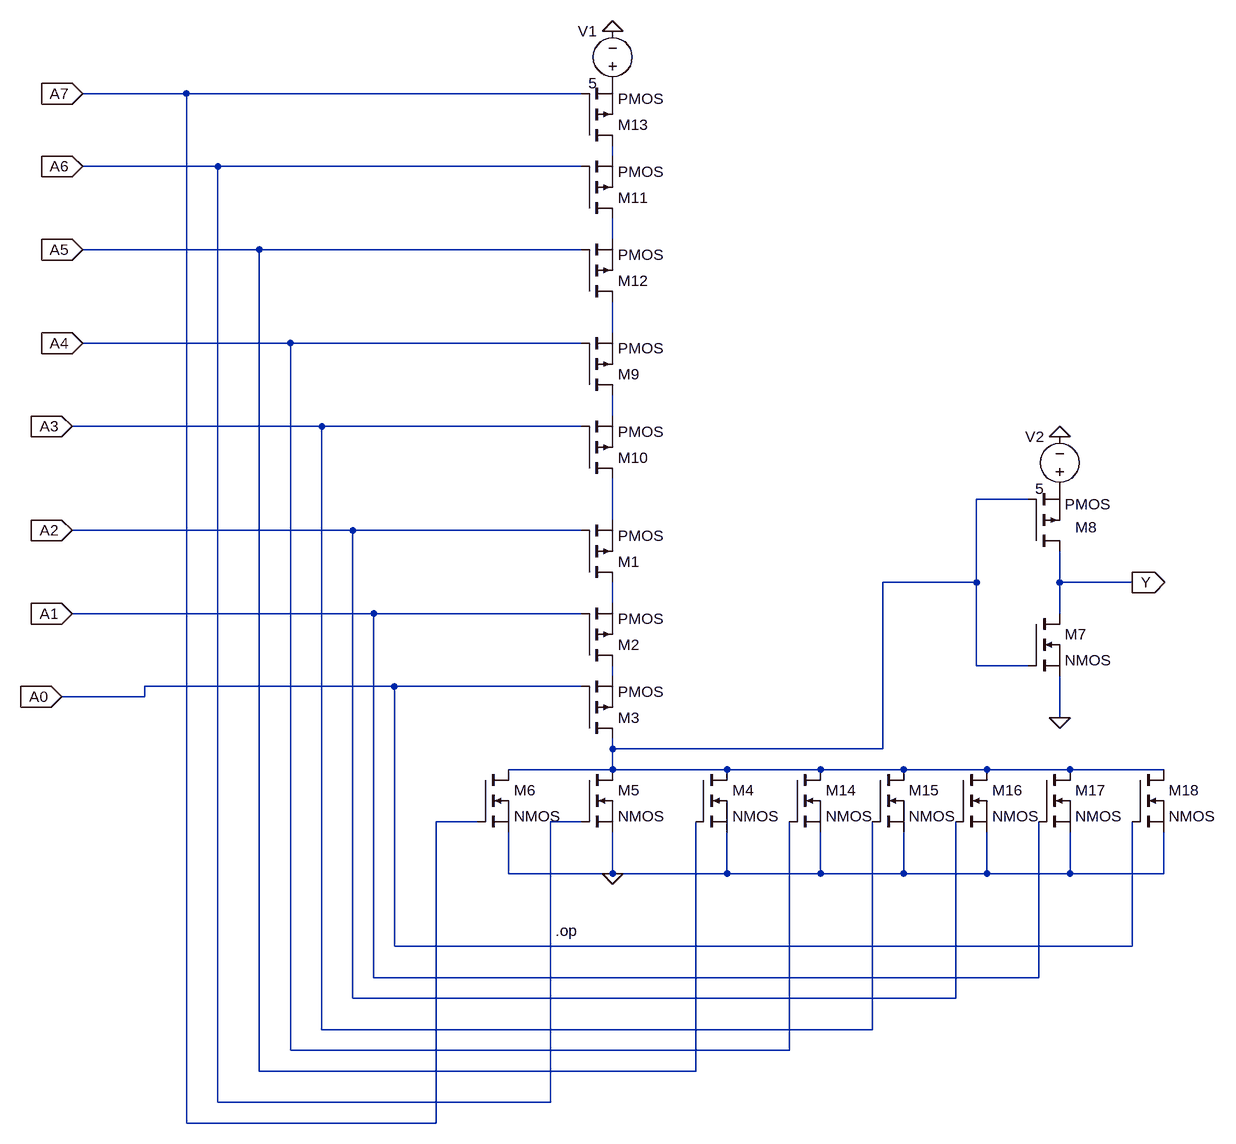
[diagram p0: schematic OR.asc]
OR.asc, the LTspice schematic file:
Version 4
SHEET 1 1532 680
WIRE -480 -1184 -640 -1184
WIRE 128 -1184 -480 -1184
WIRE 176 -1088 176 -1104
WIRE -432 -1072 -640 -1072
WIRE 128 -1072 -432 -1072
WIRE 176 -960 176 -992
WIRE -368 -944 -640 -944
WIRE 128 -944 -368 -944
WIRE 176 -816 176 -864
WIRE -320 -800 -640 -800
WIRE 128 -800 -320 -800
WIRE 176 -688 176 -720
WIRE -272 -672 -656 -672
WIRE 128 -672 -272 -672
WIRE 816 -560 736 -560
WIRE 176 -528 176 -592
WIRE -224 -512 -656 -512
WIRE 128 -512 -224 -512
WIRE 736 -432 736 -560
WIRE 736 -432 592 -432
WIRE 864 -432 864 -480
WIRE 976 -432 864 -432
WIRE 176 -400 176 -432
WIRE -192 -384 -656 -384
WIRE 128 -384 -192 -384
WIRE 864 -384 864 -432
WIRE 736 -304 736 -432
WIRE 816 -304 736 -304
WIRE 176 -288 176 -304
WIRE -160 -272 -544 -272
WIRE 128 -272 -160 -272
WIRE -544 -256 -544 -272
WIRE -544 -256 -672 -256
WIRE 864 -224 864 -288
WIRE 176 -176 176 -192
WIRE 592 -176 592 -432
WIRE 592 -176 176 -176
WIRE 176 -144 176 -176
WIRE 176 -144 16 -144
WIRE 352 -144 176 -144
WIRE 496 -144 352 -144
WIRE 624 -144 496 -144
WIRE 752 -144 624 -144
WIRE 880 -144 752 -144
WIRE 1024 -144 880 -144
WIRE 176 -128 176 -144
WIRE -32 -64 -96 -64
WIRE 128 -64 80 -64
WIRE 16 16 16 -48
WIRE 176 16 176 -48
WIRE 176 16 16 16
WIRE 352 16 352 -48
WIRE 352 16 176 16
WIRE 496 16 496 -48
WIRE 496 16 352 16
WIRE 624 16 624 -48
WIRE 624 16 496 16
WIRE 752 16 752 -48
WIRE 752 16 624 16
WIRE 880 16 880 -48
WIRE 880 16 752 16
WIRE 1024 16 1024 -48
WIRE 1024 16 880 16
WIRE -160 128 -160 -272
WIRE 976 128 976 -64
WIRE 976 128 -160 128
WIRE -192 176 -192 -384
WIRE 832 176 832 -64
WIRE 832 176 -192 176
WIRE -224 208 -224 -512
WIRE 704 208 704 -64
WIRE 704 208 -224 208
WIRE -272 256 -272 -672
WIRE 576 256 576 -64
WIRE 576 256 -272 256
WIRE -320 288 -320 -800
WIRE 448 288 448 -64
WIRE 448 288 -320 288
WIRE -368 320 -368 -944
WIRE 304 320 304 -64
WIRE 304 320 -368 320
WIRE -432 368 -432 -1072
WIRE 80 368 80 -64
WIRE 80 368 -432 368
WIRE -480 400 -480 -1184
WIRE -96 400 -96 -64
WIRE -96 400 -480 400
FLAG 976 -432 Y
IOPIN 976 -432 Out
FLAG 176 16 0
FLAG 864 -224 0
FLAG 176 -1280 0
FLAG 864 -656 0
FLAG -656 -512 A2
IOPIN -656 -512 In
FLAG -656 -384 A1
IOPIN -656 -384 In
FLAG -672 -256 A0
IOPIN -672 -256 In
FLAG -640 -944 A5
IOPIN -640 -944 In
FLAG -640 -800 A4
IOPIN -640 -800 In
FLAG -656 -672 A3
IOPIN -656 -672 In
FLAG -640 -1072 A6
IOPIN -640 -1072 In
FLAG -640 -1184 A7
IOPIN -640 -1184 In
SYMBOL pmos 128 -432 M180
SYMATTR InstName M1
SYMBOL pmos 128 -304 M180
SYMATTR InstName M2
SYMBOL pmos 128 -192 M180
SYMATTR InstName M3
SYMBOL nmos 304 -144 R0
SYMATTR InstName M4
SYMBOL nmos 128 -144 R0
SYMATTR InstName M5
SYMBOL nmos -32 -144 R0
SYMATTR InstName M6
SYMBOL nmos 816 -384 R0
SYMATTR InstName M7
SYMBOL pmos 816 -480 M180
WINDOW 0 72 37 Left 2
SYMATTR InstName M8
SYMBOL voltage 176 -1184 R180
WINDOW 0 24 96 Left 2
WINDOW 3 24 16 Left 2
SYMATTR InstName V1
SYMATTR Value 5
SYMBOL voltage 864 -560 R180
WINDOW 0 24 96 Left 2
WINDOW 3 24 16 Left 2
SYMATTR InstName V2
SYMATTR Value 5
SYMBOL pmos 128 -720 M180
SYMATTR InstName M9
SYMBOL pmos 128 -592 M180
SYMATTR InstName M10
SYMBOL pmos 128 -992 M180
SYMATTR InstName M11
SYMBOL pmos 128 -864 M180
SYMATTR InstName M12
SYMBOL pmos 128 -1104 M180
SYMATTR InstName M13
SYMBOL nmos 448 -144 R0
SYMATTR InstName M14
SYMBOL nmos 576 -144 R0
SYMATTR InstName M15
SYMBOL nmos 704 -144 R0
SYMATTR InstName M16
SYMBOL nmos 832 -144 R0
SYMATTR InstName M17
SYMBOL nmos 976 -144 R0
SYMATTR InstName M18
TEXT 88 104 Left 2 !.op

The netlist it stands for:
* OR.asc
M1 N007 A2 N006 N006 PMOS
M2 N008 A1 N007 N007 PMOS
M3 N005 A0 N008 N008 PMOS
M4 N005 A5 0 0 NMOS
M5 N005 A6 0 0 NMOS
M6 N005 A7 0 0 NMOS
M7 Y N005 0 0 NMOS
M8 Y N005 P001 P001 PMOS
V1 P002 0 5
V2 P001 0 5
M9 N004 A4 N003 N003 PMOS
M10 N006 A3 N004 N004 PMOS
M11 N002 A6 N001 N001 PMOS
M12 N003 A5 N002 N002 PMOS
M13 N001 A7 P002 P002 PMOS
M14 N005 A4 0 0 NMOS
M15 N005 A3 0 0 NMOS
M16 N005 A2 0 0 NMOS
M17 N005 A1 0 0 NMOS
M18 N005 A0 0 0 NMOS
.model NMOS NMOS
.model PMOS PMOS
.lib standard.mos
.op
.backanno
.end